# Altium schematic sheet PowerManagement.SchDoc
size A4; SheetNumber: 1; SheetTotal: 3
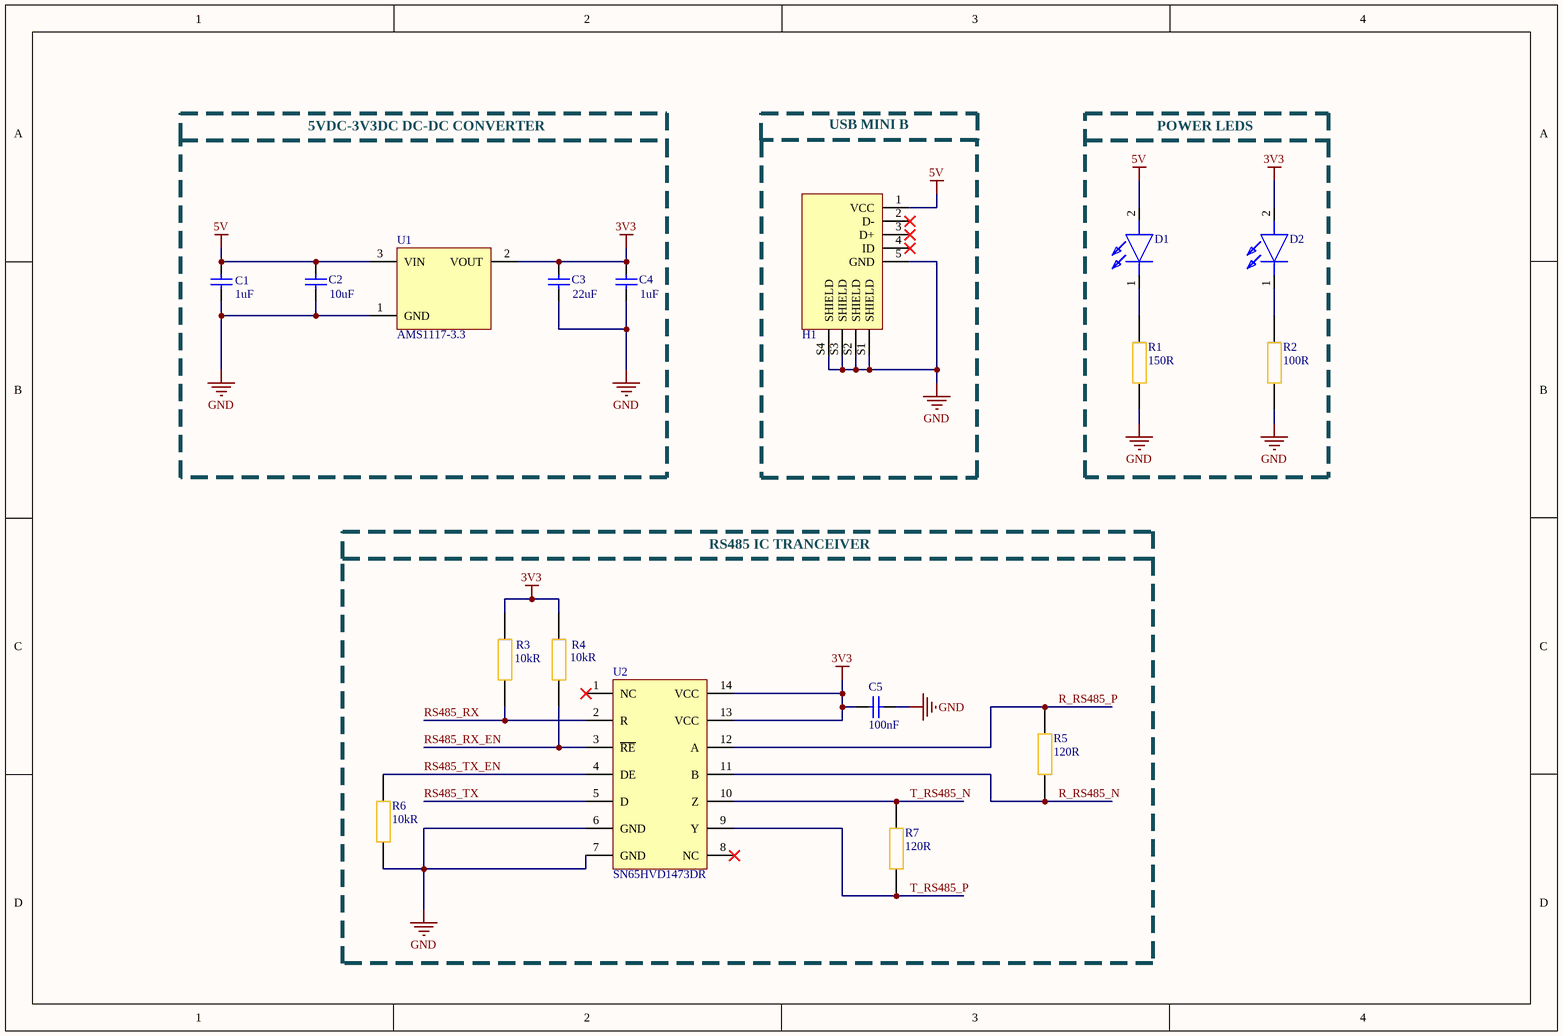
[diagram p0: PowerManagement.SchDoc]

## Parts
C1  1uF  [WCAP-CSGP_0603_L1.6W0.8H0.8_Reflow]
C2  10uF  [WCAP-CSGP_0603_L1.6W0.8H0.8_Reflow]
C3  22uF  [WCAP-CSGP_0805_L2W1.25H1.25]
C4  1uF  [WCAP-CSGP_0603_L1.6W0.8H0.8_Reflow]
C5  100nF  [WCAP-CSGP_0603_L1.6W0.8H0.8_Reflow]
D1  APT1608SGC  [LED GREEN]  (value not drawn)
D2  APT1608SGC  [LED GREEN]  (value not drawn)
H1  690-005-299-043  [USB]  (value not drawn)
R1  Resistance: 150R  [RES 0603]  (hidden comment: RC0603FR-07150RL)
R2  Resistance: 100R  [RES 0603]  (hidden comment: RC0603FR-13100RL)
R3  Resistance: 10kR  [RES 0603]  (hidden comment: RC0603FR-0710KP)
R4  Resistance: 10kR  [RES 0603]  (hidden comment: RC0603FR-0710KP)
R5  Resistance: 120R  [RES 0603]  (hidden comment: RC0603FR-07120RL)
R6  Resistance: 10kR  [RES 0603]  (hidden comment: RC0603FR-0710KP)
R7  Resistance: 120R  [RES 0603]  (hidden comment: RC0603FR-07120RL)
U1  AMS1117-3.3  [SOT-223]
U2  SN65HVD1473DR  [14-SOIC]

## Blocks framed on the sheet
5VDC-3V3DC DC-DC CONVERTER: C1-C4 U1
USB MINI B: H1
RS485 IC TRANCEIVER: C5 R3-R7 U2

## Nets
3V3: C3.2 C4.2 C5.2 D2.2(A) R3.2 R4.2 U1.2(VOUT) U2.13(VCC) U2.14(VCC)
5V: C1.2 C2.2 D1.2(A) H1.1(VCC) U1.3(VIN)
GND: C1.1 C2.1 C3.1 C4.1 C5.1 H1.5(GND) H1.S1(SHIELD) H1.S2(SHIELD) H1.S3(SHIELD) H1.S4(SHIELD) R1.1 R2.1 R6.2 U1.1(GND) U2.6(GND) U2.7(GND)
R_RS485_N: R5.2 U2.11(B)
R_RS485_P: R5.1 U2.12(A)
RS485_RX: R3.1 U2.2(R)
RS485_RX_EN: R4.1 U2.3(~{RE})
RS485_TX: U2.5(D)
RS485_TX_EN: R6.1 U2.4(DE)
T_RS485_N: R7.2 U2.10(Z)
T_RS485_P: R7.1 U2.9(Y)
NetD1_1: D1.1(K) R1.2
NetD2_1: D2.1(K) R2.2

Not connected (* = marked no-connect by the designer): H1 2(D-)* 3(D+)* 4(ID)*; U2 1(NC)* 8(NC)*

## Notes on the sheet
- POWER LEDS

## Library data of the parts
C1 C4 = 885012106010: WCAP-CSGP Multilayer Ceramic Chip Capacitor, General Purpose, size 0603, X5R, 1µF, 10VDC; Manufacturer: Wurth Elektronik; Case/Size Code: 0603; Capacitance Tolerance: +/-20%; Dissipation Factor: 10%; Insulation Resistance: 0.1GOhm; Rated Voltage (DC): 10V; Technical Reference: X5R0603105M010DFCT10000; Manufacturer Part Number: 885012106010; Category: Multilayer Ceramic Chip Capacitors; Match Code: WCAP-CSGP; ComponentLink1Description: Website Link; ComponentLink1URL: https://www.we-online.com/redexpert/article/885012106010?ad; ComponentLink2Description: Datasheet Link; ComponentLink2URL: https://www.we-online.com/redexpert/spec/885012106010?ad; Mount: Surface Mount; Operating Temperature Max: 85°C; Operating Temperature Min: -55°C; Packaging: Tape and Reel; Length: 1.6mm; Width: 0.8mm; Height: 0.8mm; Capacitance: 1uF; Ceramic Type: X5R
C2 = 885012106031: WCAP-CSGP Multilayer Ceramic Chip Capacitor, General Purpose, size 0603, X5R, 10µF, 25VDC; Manufacturer: Wurth Elektronik; Case/Size Code: 0603; Capacitance Tolerance: +/20%; Dissipation Factor: 20%; Insulation Resistance: 0.01GOhm; Rated Voltage (DC): 25V; Technical Reference: X5R0603106M025DFCT10000; Manufacturer Part Number: 885012106031; Category: Multilayer Ceramic Chip Capacitors; Match Code: WCAP-CSGP; ComponentLink1Description: Website Link; ComponentLink1URL: https://www.we-online.com/redexpert/article/885012106031?ad; ComponentLink2Description: Datasheet Link; ComponentLink2URL: https://www.we-online.com/redexpert/spec/885012106031?ad; Mount: Surface Mount; Operating Temperature Max: 85°C; Operating Temperature Min: -55°C; Packaging: Tape and Reel; Length: 1.6mm; Width: 0.8mm; Height: 0.8mm; Capacitance: 10uF; Ceramic Type: X5R
C3 = 885012107011: WCAP-CSGP Multilayer Ceramic Chip Capacitor, General Purpose, size 0805, X5R, 22µF, 10VDC; Manufacturer: Wurth Elektronik; Case/Size Code: 0805; Capacitance Tolerance: +/-20%; Dissipation Factor: 10%; Insulation Resistance: 0.005GOhm; Rated Voltage (DC): 10V; Technical Reference: X5R0805226M010DFCT10000; Manufacturer Part Number: 885012107011; Category: Multilayer Ceramic Chip Capacitors; Match Code: WCAP-CSGP; ComponentLink1Description: Website Link; ComponentLink1URL: https://www.we-online.com/redexpert/article/885012107011?ad; ComponentLink2Description: Datasheet Link; ComponentLink2URL: https://www.we-online.com/redexpert/spec/885012107011?ad; Mount: Surface Mount; Operating Temperature Max: 85°C; Operating Temperature Min: -55°C; Packaging: Tape and Reel; Length: 2mm; Width: 1.25mm; Height: 1.25mm; Capacitance: 22uF; Ceramic Type: X5R
C5 = 885012206046: WCAP-CSGP Multilayer Ceramic Chip Capacitor, General Purpose, size 0603, X7R, 100nF, 16VDC; Manufacturer: Wurth Elektronik; Case/Size Code: 0603; Capacitance Tolerance: +/-10%; Dissipation Factor: 3.5%; Insulation Resistance: 5GOhm; Rated Voltage (DC): 16V; Technical Reference: X7R0603104K016DFCT10000; Manufacturer Part Number: 885012206046; Category: Multilayer Ceramic Chip Capacitors; Match Code: WCAP-CSGP; ComponentLink1Description: Website Link; ComponentLink1URL: https://www.we-online.com/redexpert/article/885012206046?ad; ComponentLink2Description: Datasheet Link; ComponentLink2URL: https://www.we-online.com/redexpert/spec/885012206046?ad; Mount: Surface Mount; Operating Temperature Max: 125°C; Operating Temperature Min: -55°C; Packaging: Tape and Reel; Length: 1.6mm; Width: 0.8mm; Height: 0.8mm; Capacitance: 100nF; Ceramic Type: X7R
D1 D2 = APT1608SGC: LED GREEN CLEAR 0603 SMD; Manufacturer: Kingbright; Forward Voltage: 2.2V; Viewing Angle: 120°; Forward Current: 20mA; Luminous Intensity: 15mcd; Lens Style: Clear,Flat; Dominant Wavelength: 568nm; Number of LEDs: 1; Designed by: ADAK; Supplier 1: Digi-Key; Manufacturer Part Number: APT1608SGC; RoHS: Yes; Category: LEDs; Stock 1: 356278; Pricing 1: 1=0,3, 10=0,237, 100=0,1064, 500=0,0961, 1000=0,07894 (USD); Mount: Surface Mount; Case/Package: 0603; Number of Pins: 2; Color: Green; Case Code (Metric): 1608; Case Code (Imperial): 0603; Lens Color: Clear; Min Operating Temperature: -40°C; Max Operating Temperature: 85°C; Package Quantity: 2000; Illumination Color: Green; Packaging: Tape and Reel; Test Current: 20mA; Wavelength: 568nm; Series: APT; Length: 1.6mm; Width: 0.8mm; Height: 0.75mm; Lead Free: Lead Free; RoHS Compliant: Yes; ComponentLink1URL: https://datasheet.ciiva.com/12400/apt1608sgc-32861-12400932.pdf?src-supplier=Mouser; ComponentLink1Description: https://datasheet.ciiva.com/12400/apt1608sgc-32861-12400932.pdf?src-supplier=Mouser; ComponentLink2URL: https://datasheet.ciiva.com/2113/apt1608sgc-2113808.pdf?src-supplier=Digi-Key; ComponentLink2Description: https://datasheet.ciiva.com/2113/apt1608sgc-2113808.pdf?src-supplier=Digi-Key; ComponentLink3URL: https://datasheet.ciiva.com/14603/70062839-14603927.pdf?src-supplier=Allied+Electronics; ComponentLink3Description: https://datasheet.ciiva.com/14603/70062839-14603927.pdf?src-supplier=Allied+Electronics; Supplier Part Number 1: 754-1121-1-ND
H1 = USB Mini B: CONN RCPT USB2.0 MINI B SMD R/A; Manufacturer: EDAC; Number of Contacts: 5; Gender: Receptacle; Number of Ports: 1; Mating Cycles: 1500; Shielding: Unshielded; Pitch: 0.8mm; Designed by: ADAK; Supplier 1: Digi-Key; Manufacturer Part Number: 690-005-299-043; RoHS: No; Category: USB Connectors; Stock 1: 72958; Pricing 1: 1=0,65, 10=0,564, 25=0,5152, 50=0,4848, 100=0,4646, 250=0,4242, 500=0,404 (USD); Mount: Surface Mount,Horizontal; Color: Black; Contact Material: Bronze; Contact Plating: Gold; Housing Material: Thermoplastic; Insulation Color: Black; Min Operating Temperature: -30°C; Max Operating Temperature: 80°C; Packaging: Cut Tape; Connector Type: USB; Termination: Solder; Orientation: Right Angle; Series: 690; Lead Free: Lead Free; Flammability Rating: UL94 V-0; ComponentLink1URL: https://datasheet.ciiva.com/30246/690-005-299-043-30246515.pdf?src-supplier=Onlinecomponents.com; ComponentLink1Description: https://datasheet.ciiva.com/30246/690-005-299-043-30246515.pdf?src-supplier=Onlinecomponents.com; ComponentLink2URL: https://datasheet.ciiva.com/29660/690-005-299-043-29660027.pdf?src-supplier=Digi-Key; ComponentLink2Description: https://datasheet.ciiva.com/29660/690-005-299-043-29660027.pdf?src-supplier=Digi-Key; ComponentLink3URL: https://datasheet.ciiva.com/29660/690-005-299-043-29660028.pdf?src-supplier=Digi-Key; ComponentLink3Description: https://datasheet.ciiva.com/29660/690-005-299-043-29660028.pdf?src-supplier=Digi-Key; ComponentLink4URL: https://datasheet.ciiva.com/29660/690-005-299-043-29660029.pdf?src-supplier=Digi-Key; ComponentLink4Description: https://datasheet.ciiva.com/29660/690-005-299-043-29660029.pdf?src-supplier=Digi-Key; Supplier Part Number 1: 151-1206-1-ND
R1 = RES 150 OHM 0603: RES 150 OHM 1% 1/10W 0603 SMD; Manufacturer: Yageo; Power Rating: 100mW; Voltage Rating: 50V; Temperature Coefficient: 100ppm/°C; Designed by: ADAK; Supplier 1: Digi-Key; Manufacturer Part Number: RC0603FR-07150RL; RoHS: Yes; Category: Chip SMD Resistors; Stock 1: 1463209; Pricing 1: 1=0,1, 10=0,018, 50=0,0106, 100=0,0088, 500=0,00592, 1000=0,00505 (USD); Case/Package: 0603; Number of Pins: 2; Case Code (Imperial): 0603; Case Code (Metric): 1608; Size Code: 0603; Min Operating Temperature: -55°C; Max Operating Temperature: 155°C; Tolerance: 1%; Voltage Rating (DC): 50V; Packaging: Tape and Reel; Package Quantity: 5000; Termination: SMD/SMT; Resistor Type: Thick Film; Features: Moisture Resistant; Series: RC; Max Power Dissipation: 100mW; Number of Terminations: 2; Resistance Tolerance: 1%; Length: 1.6mm; Width: 0.8mm; Height: 0.45mm; Reach SVHC Compliant: No; Lead Free: Lead Free; RoHS Compliant: Yes; ComponentLink1URL: https://datasheet.ciiva.com/46412/443971-46412844.pdf?src-supplier=Element14; ComponentLink1Description: https://datasheet.ciiva.com/46412/443971-46412844.pdf?src-supplier=Element14; ComponentLink2URL: https://datasheet.ciiva.com/46440/1868787-46440893.pdf?src-supplier=Element14; ComponentLink2Description: https://datasheet.ciiva.com/46440/1868787-46440893.pdf?src-supplier=Element14; ComponentLink3URL: https://datasheet.ciiva.com/12555/rc0603-272842-12555301.pdf?src-supplier=Mouser; ComponentLink3Description: https://datasheet.ciiva.com/12555/rc0603-272842-12555301.pdf?src-supplier=Mouser; Supplier Part Number 1: 311-150HRCT-ND
R2 = RES 100 OHM 0603: RES 100 OHM 1% 1/10W 0603 SMD; Manufacturer: Yageo; Power Rating: 100mW; Voltage Rating: 50V; Temperature Coefficient: 100ppm/°C; Designed by: ADAK; Supplier 1: Digi-Key; Manufacturer Part Number: RC0603FR-13100RL; RoHS: Yes; Category: Chip SMD Resistors; Stock 1: 77195; Pricing 1: 1=0,1, 10=0,018, 50=0,0106, 100=0,0088, 500=0,00592, 1000=0,00505, 5000=0,00363, 10000=0,00318 (USD); Case/Package: 0603; Number of Pins: 2; Case Code (Imperial): 0603; Case Code (Metric): 1608; Size Code: 0603; Min Operating Temperature: -55°C; Max Operating Temperature: 155°C; Tolerance: 1%; Packaging: Tape and Reel; Termination: SMD/SMT; Resistor Type: Thick Film; Voltage Rating (DC): 50V; Series: RC; Resistance Tolerance: 1%; Length: 1.6mm; Width: 0.8mm; Height: 0.45mm; Reach SVHC Compliant: No; Lead Free: Lead Free; RoHS Compliant: Yes; ComponentLink1URL: https://datasheet.ciiva.com/7983/443971-7983671.pdf?src-supplier=Element14; ComponentLink1Description: https://datasheet.ciiva.com/7983/443971-7983671.pdf?src-supplier=Element14; ComponentLink2URL: https://datasheet.ciiva.com/12561/rc0603-272842-12561884.pdf?src-supplier=Mouser; ComponentLink2Description: https://datasheet.ciiva.com/12561/rc0603-272842-12561884.pdf?src-supplier=Mouser; Supplier Part Number 1: 13-RC0603FR-13100RLCT-ND
R3 R4 R6 = RES 10K OHM 0603: RES 10K OHM 1% 1/10W 0603 SMD; Manufacturer: Yageo; Max Power Dissipation: 100mW; Temperature Coefficient: 150ppm/°C; Designed by: ADAK; Supplier 1: Digi-Key; Manufacturer Part Number: RC0603FR-0710KP; RoHS: Yes; Category: Chip SMD Resistors; Stock 1: 239190; Pricing 1: 1=0,1, 10=0,024, 50=0,0154, 100=0,0129, 500=0,00892, 1000=0,0077 (USD); Case/Package: 0603; Case Code (Metric): 1608; Case Code (Imperial): 0603; Min Operating Temperature: -55°C; Max Operating Temperature: 155°C; Packaging: Cut Tape; Number of Terminations: 2; Tolerance: 1%; Features: Moisture Resistant; Series: RC-P Lead Free; Length: 0.063inch; Width: 0.031inch; Height: 0.022inch; RoHS Compliant: Yes; ComponentLink1URL: https://www.mouser.com/ds/2/447/yageodocoutput-1115409.pdf?src-supplier=Mouser; ComponentLink1Description: https://www.mouser.com/ds/2/447/yageodocoutput-1115409.pdf?src-supplier=Mouser; ComponentLink2URL: http://www.yageo.com/NewPortal/yageodocoutput?fileName=/pdf/R-Chip/PYu-RC_51_RoHS_P_0.pdf&src-supplier=Digi-Key; ComponentLink2Description: http://www.yageo.com/NewPortal/yageodocoutput?fileName=/pdf/R-Chip/PYu-RC_51_RoHS_P_0.pdf&src-supplier=Digi-Key; ComponentLink3URL: http://www.yageo.com.tw/exep/pages/download/literatures/PYu-R_INT-thick_7.pdf?src-supplier=Digi-Key; ComponentLink3Description: http://www.yageo.com.tw/exep/pages/download/literatures/PYu-R_INT-thick_7.pdf?src-supplier=Digi-Key; Supplier Part Number 1: YAG1290CT-ND
R5 R7 = RES 120 OHM 0603: RES 120 OHM 1% 1/10W 0603 SMD; Manufacturer: Yageo; Voltage Rating (DC): 50V; Temperature Coefficient: 100ppm/°C; Power Rating: 100mW; Designed by: ADAK; Supplier 1: Digi-Key; Manufacturer Part Number: RC0603FR-07120RL; RoHS: Yes; Category: Chip SMD Resistors; Stock 1: 665150; Pricing 1: 1=0,1, 10=0,018, 50=0,0106, 100=0,0088, 500=0,00592, 1000=0,00505 (USD); Case/Package: 0603; Number of Pins: 2; Case Code (Metric): 1608; Case Code (Imperial): 0603; Size Code: 0603; Min Operating Temperature: -55°C; Max Operating Temperature: 155°C; Tolerance: 1%; Packaging: Tape and Reel; Resistor Type: Thick Film; Voltage Rating: 50V; Package Quantity: 1; Number of Terminations: 2; Termination: SMD/SMT; Max Power Dissipation: 100mW; Features: Moisture Resistant; Series: RC; Construction: Rectangular; Resistance Tolerance: 1%; Length: 0.063inch; Width: 0.031inch; Height: 0.022inch; Depth: 0.8mm; Reach SVHC Compliant: No; Lead Free: Lead Free; Military Standard: Not; RoHS Compliant: Yes; ComponentLink1URL: https://datasheet.ciiva.com/46395/443971-46395021.pdf?src-supplier=Element14; ComponentLink1Description: https://datasheet.ciiva.com/46395/443971-46395021.pdf?src-supplier=Element14; ComponentLink2URL: https://datasheet.ciiva.com/2553/pyu-r-int-thick-7-2553513.pdf?src-supplier=Digi-Key; ComponentLink2Description: https://datasheet.ciiva.com/2553/pyu-r-int-thick-7-2553513.pdf?src-supplier=Digi-Key; ComponentLink3URL: https://datasheet.ciiva.com/2553/pyu-r-int-thick-7-2553514.pdf?src-supplier=Digi-Key; ComponentLink3Description: https://datasheet.ciiva.com/2553/pyu-r-int-thick-7-2553514.pdf?src-supplier=Digi-Key; ComponentLink4URL: https://datasheet.ciiva.com/2553/pyu-r-int-thick-7-2553512.pdf?src-supplier=Digi-Key; ComponentLink4Description: https://datasheet.ciiva.com/2553/pyu-r-int-thick-7-2553512.pdf?src-supplier=Digi-Key; ComponentLink5URL: https://datasheet.ciiva.com/7746/443971-7746249.pdf?src-supplier=Element14; ComponentLink5Description: https://datasheet.ciiva.com/7746/443971-7746249.pdf?src-supplier=Element14; ComponentLink6URL: https://datasheet.ciiva.com/7746/443971-7746248.pdf?src-supplier=Element14; ComponentLink6Description: https://datasheet.ciiva.com/7746/443971-7746248.pdf?src-supplier=Element14; Supplier Part Number 1: 311-120HRCT-ND
U1 = AMS1117-3.3: Low Dropout Voltage Regulatator SOT-223 1A 3.3V; Designed by: ADAK; Package: SOT-223; Voltage-Ouptut(Fixed): 3.3V; Current: 1A
U2 = SN65HVD1473DR: IC TRANSCEIVER FULL 1/1 14SOIC; Manufacturer: Texas Instruments; Designed by: ADAK; Supplier 1: Digi-Key; Manufacturer Part Number: SN65HVD1473DR; RoHS: Yes; Category: Interface ICs; Stock 1: 2430; Pricing 1: 1=4,39, 10=3,94, 25=3,7248, 100=3,228, 250=3,06248, 500=2,74794, 1000=2,31755 (USD); ComponentLink1URL: http://www.ti.com/general/docs/suppproductinfo.tsp?distId=10&amp;gotoUrl=http%3A%2F%2Fwww.ti.com%2Flit%2Fgpn%2Fsn65hvd1473&src-supplier=Digi-Key; ComponentLink1Description: http://www.ti.com/general/docs/suppproductinfo.tsp?distId=10&amp;gotoUrl=http%3A%2F%2Fwww.ti.com%2Flit%2Fgpn%2Fsn65hvd1473&src-supplier=Digi-Key; ComponentLink2URL: http://www.ti.com/lit/ds/symlink/sn65hvd1473.pdf?src-supplier=Digi-Key; ComponentLink2Description: http://www.ti.com/lit/ds/symlink/sn65hvd1473.pdf?src-supplier=Digi-Key; ComponentLink3URL: http://www.ti.com/general/docs/lit/getliterature.tsp?genericPartNumber=SN65HVD1477&&fileType=pdf&src-supplier=Avnet; ComponentLink3Description: http://www.ti.com/general/docs/lit/getliterature.tsp?genericPartNumber=SN65HVD1477&&fileType=pdf&src-supplier=Avnet; Supplier Part Number 1: 296-40505-1-ND